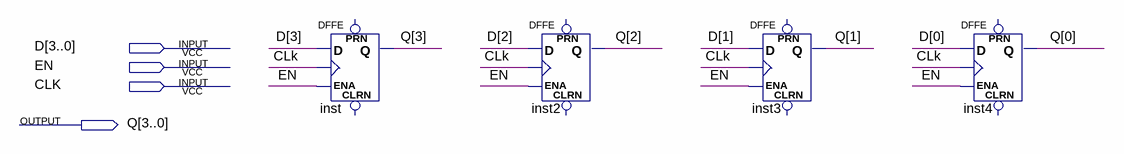
[diagram p0: schematic sheet]
// Quartus schematic DFF_4bit.bdf as structural Verilog: 4 symbols, 4 pins
module DFF_4bit (
  input  [3:0] D,
  input  EN,
  input  CLK,
  output [3:0] Q
);

  DFFE inst (.D(D[3]), .CLK(CLK), .ENA(EN), .Q(Q[3]));  // open: PRN, CLRN
  DFFE inst2 (.D(D[2]), .CLK(CLK), .ENA(EN), .Q(Q[2]));  // open: PRN, CLRN
  DFFE inst3 (.D(D[1]), .CLK(CLK), .ENA(EN), .Q(Q[1]));  // open: PRN, CLRN
  DFFE inst4 (.D(D[0]), .CLK(CLK), .ENA(EN), .Q(Q[0]));  // open: PRN, CLRN
endmodule
